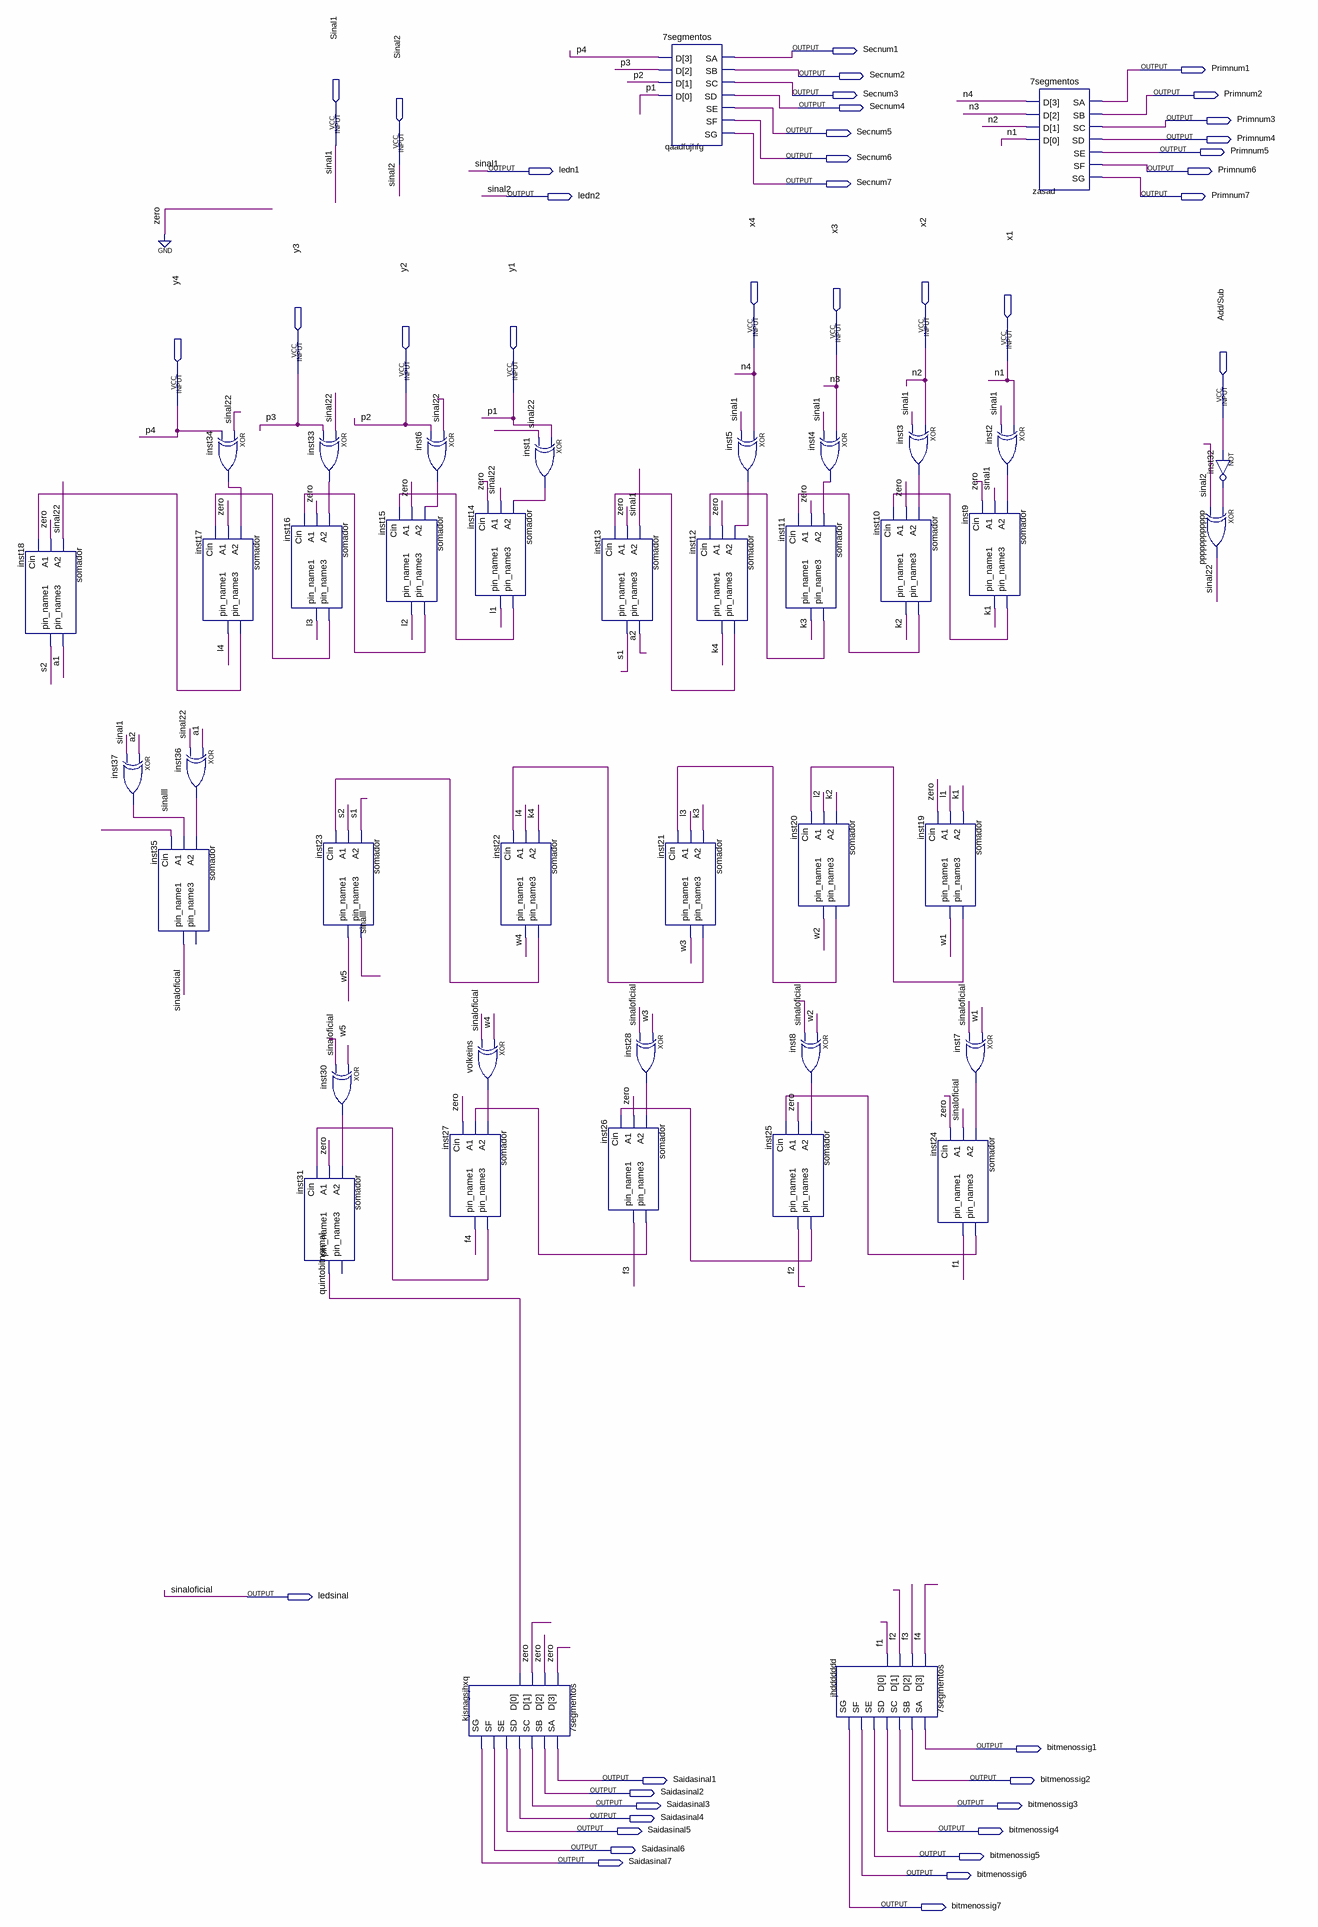
[diagram p0: schematic sheet]
// Quartus schematic sub.bdf as structural Verilog: 42 symbols, 42 pins
module sub (
  input  Sinal1,
  input  Sinal2,
  input  x4,
  input  x2,
  input  x3,
  input  x1,
  input  y3,
  input  y2,
  input  y1,
  input  y4,
  input  \Add/Sub ,
  output Secnum1,
  output Primnum1,
  output Secnum2,
  output Secnum3,
  output Primnum2,
  output Secnum4,
  output Primnum3,
  output Secnum5,
  output Primnum4,
  output Primnum5,
  output Secnum6,
  output ledn1,
  output Primnum6,
  output Secnum7,
  output ledn2,
  output Primnum7,
  output ledsinal,
  output bitmenossig1,
  output Saidasinal1,
  output bitmenossig2,
  output Saidasinal2,
  output Saidasinal3,
  output bitmenossig3,
  output Saidasinal4,
  output Saidasinal5,
  output bitmenossig4,
  output Saidasinal6,
  output bitmenossig5,
  output Saidasinal7,
  output bitmenossig6,
  output bitmenossig7
);

  wire a1, a2, f1, f2, f3, f4, inst1_out, inst2_out, inst3_out, inst4_out, inst5_out, inst6_out, inst7_out,
       inst8_out, inst9_pin_name3, inst10_pin_name3, inst11_pin_name3, inst12_pin_name3, inst14_pin_name3,
       inst15_pin_name3, inst16_pin_name3, inst17_pin_name3, inst19_pin_name3, inst20_pin_name3,
       inst21_pin_name3, inst22_pin_name3, inst24_pin_name3, inst25_pin_name3, inst26_pin_name3,
       inst27_pin_name3, inst28_out, inst30_out, inst32_out, inst33_out, inst34_out, inst36_out, inst37_out,
       k1, k2, k3, k4, l1, l2, l3, l4, quintobitnormal, s1, s2, sinal22, sinalll, volkeins_out, w1, w2, w3,
       w4, w5;

  somador inst18 (.A2(sinal22), .A1(1'b0), .Cin(inst17_pin_name3), .pin_name3(a1), .pin_name1(s2));
  xor inst37 (inst37_out, a2, Sinal1);
  somador inst35 (.A2(inst36_out), .A1(inst37_out), .Cin(sinalll), .pin_name1(ledsinal));  // open: pin_name3
  xor inst34 (inst34_out, sinal22, y4);
  somador inst17 (.A2(inst34_out), .A1(1'b0), .Cin(inst16_pin_name3), .pin_name3(inst17_pin_name3), .pin_name1(l4));
  xor inst36 (inst36_out, a1, sinal22);
  xor inst33 (inst33_out, sinal22, y3);
  somador inst16 (.A2(inst33_out), .A1(1'b0), .Cin(inst15_pin_name3), .pin_name3(inst16_pin_name3), .pin_name1(l3));
  somador inst23 (.A2(s1), .A1(s2), .Cin(inst22_pin_name3), .pin_name3(sinalll), .pin_name1(w5));
  xor inst30 (inst30_out, w5, ledsinal);
  somador inst31 (.A2(inst30_out), .A1(1'b0), .Cin(inst27_pin_name3), .pin_name1(quintobitnormal));  // open: pin_name3
  somador inst15 (.A2(inst6_out), .A1(1'b0), .Cin(inst14_pin_name3), .pin_name3(inst15_pin_name3), .pin_name1(l2));
  xor inst6 (inst6_out, sinal22, y2);
  somador inst14 (.A2(inst1_out), .A1(sinal22), .Cin(1'b0), .pin_name3(inst14_pin_name3), .pin_name1(l1));
  xor volkeins (volkeins_out, w4, ledsinal);
  somador inst27 (.A2(volkeins_out), .A1(inst26_pin_name3), .Cin(1'b0), .pin_name3(inst27_pin_name3), .pin_name1(f4));
  \7segmentos  kjsnagsjhxq (
    .D({3'b000, quintobitnormal}), .SA(Saidasinal1), .SB(Saidasinal2), .SC(Saidasinal3), .SD(Saidasinal4),
    .SE(Saidasinal5), .SF(Saidasinal6), .SG(Saidasinal7));
  xor inst1 (inst1_out, y1, sinal22);
  somador inst22 (.A2(k4), .A1(l4), .Cin(inst21_pin_name3), .pin_name3(inst22_pin_name3), .pin_name1(w4));
  somador inst13 (.A2(Sinal1), .A1(1'b0), .Cin(inst12_pin_name3), .pin_name3(a2), .pin_name1(s1));
  xor inst28 (inst28_out, w3, ledsinal);
  somador inst26 (.A2(inst28_out), .A1(1'b0), .Cin(inst25_pin_name3), .pin_name3(inst26_pin_name3), .pin_name1(f3));
  \7segmentos  qaadfujhfg (
    .D({y4, y3, y2, y1}), .SA(Secnum1), .SB(Secnum2), .SC(Secnum3), .SD(Secnum4), .SE(Secnum5), .SF(Secnum6),
    .SG(Secnum7));
  somador inst21 (.A2(k3), .A1(l3), .Cin(inst20_pin_name3), .pin_name3(inst21_pin_name3), .pin_name1(w3));
  xor inst5 (inst5_out, x4, Sinal1);
  somador inst12 (.A2(inst5_out), .A1(1'b0), .Cin(inst11_pin_name3), .pin_name3(inst12_pin_name3), .pin_name1(k4));
  somador inst11 (.A2(inst4_out), .A1(1'b0), .Cin(inst10_pin_name3), .pin_name3(inst11_pin_name3), .pin_name1(k3));
  somador inst25 (.A2(inst8_out), .A1(1'b0), .Cin(inst24_pin_name3), .pin_name3(inst25_pin_name3), .pin_name1(f2));
  xor inst4 (inst4_out, x3, Sinal1);
  somador inst20 (.A2(k2), .A1(l2), .Cin(inst19_pin_name3), .pin_name3(inst20_pin_name3), .pin_name1(w2));
  xor inst8 (inst8_out, w2, ledsinal);
  \7segmentos  jhddddddd (
    .D({f4, f3, f2, f1}), .SA(bitmenossig1), .SB(bitmenossig2), .SC(bitmenossig3), .SD(bitmenossig4),
    .SE(bitmenossig5), .SF(bitmenossig6), .SG(bitmenossig7));
  somador inst10 (.A2(inst3_out), .A1(1'b0), .Cin(inst9_pin_name3), .pin_name3(inst10_pin_name3), .pin_name1(k2));
  xor inst3 (inst3_out, x2, Sinal1);
  somador inst19 (.A2(k1), .A1(l1), .Cin(1'b0), .pin_name3(inst19_pin_name3), .pin_name1(w1));
  somador inst24 (.A2(inst7_out), .A1(ledsinal), .Cin(1'b0), .pin_name3(inst24_pin_name3), .pin_name1(f1));
  somador inst9 (.A2(inst2_out), .A1(Sinal1), .Cin(1'b0), .pin_name3(inst9_pin_name3), .pin_name1(k1));
  xor inst7 (inst7_out, w1, ledsinal);
  \7segmentos  zasad (
    .D({x4, x3, x2, x1}), .SA(Primnum1), .SB(Primnum2), .SC(Primnum3), .SD(Primnum4), .SE(Primnum5),
    .SF(Primnum6), .SG(Primnum7));
  xor inst2 (inst2_out, x1, Sinal1);
  not inst32 (inst32_out, \Add/Sub );
  xor pppppppppppp (sinal22, inst32_out, Sinal2);

  assign ledn1 = Sinal1;
  assign ledn2 = Sinal2;

  // Other names for the same wires on the sheet: n1 = x1; n2 = x2; n3 = x3; n4 = x4; p1 = y1; p2 = y2; p3 = y3;
  //   sinaloficial = ledsinal; p4 = y4
endmodule
